# Altium schematic sheet 01.SchDoc
size A3; CompanyName: 瀬沼電子; Organization: 瀬沼電子; Address1: 〒197-0827; Address2: 東京都あきる野; Address3: 油平259; Phone: 042-558-0141; Rule: PcbType=ProtelPcb
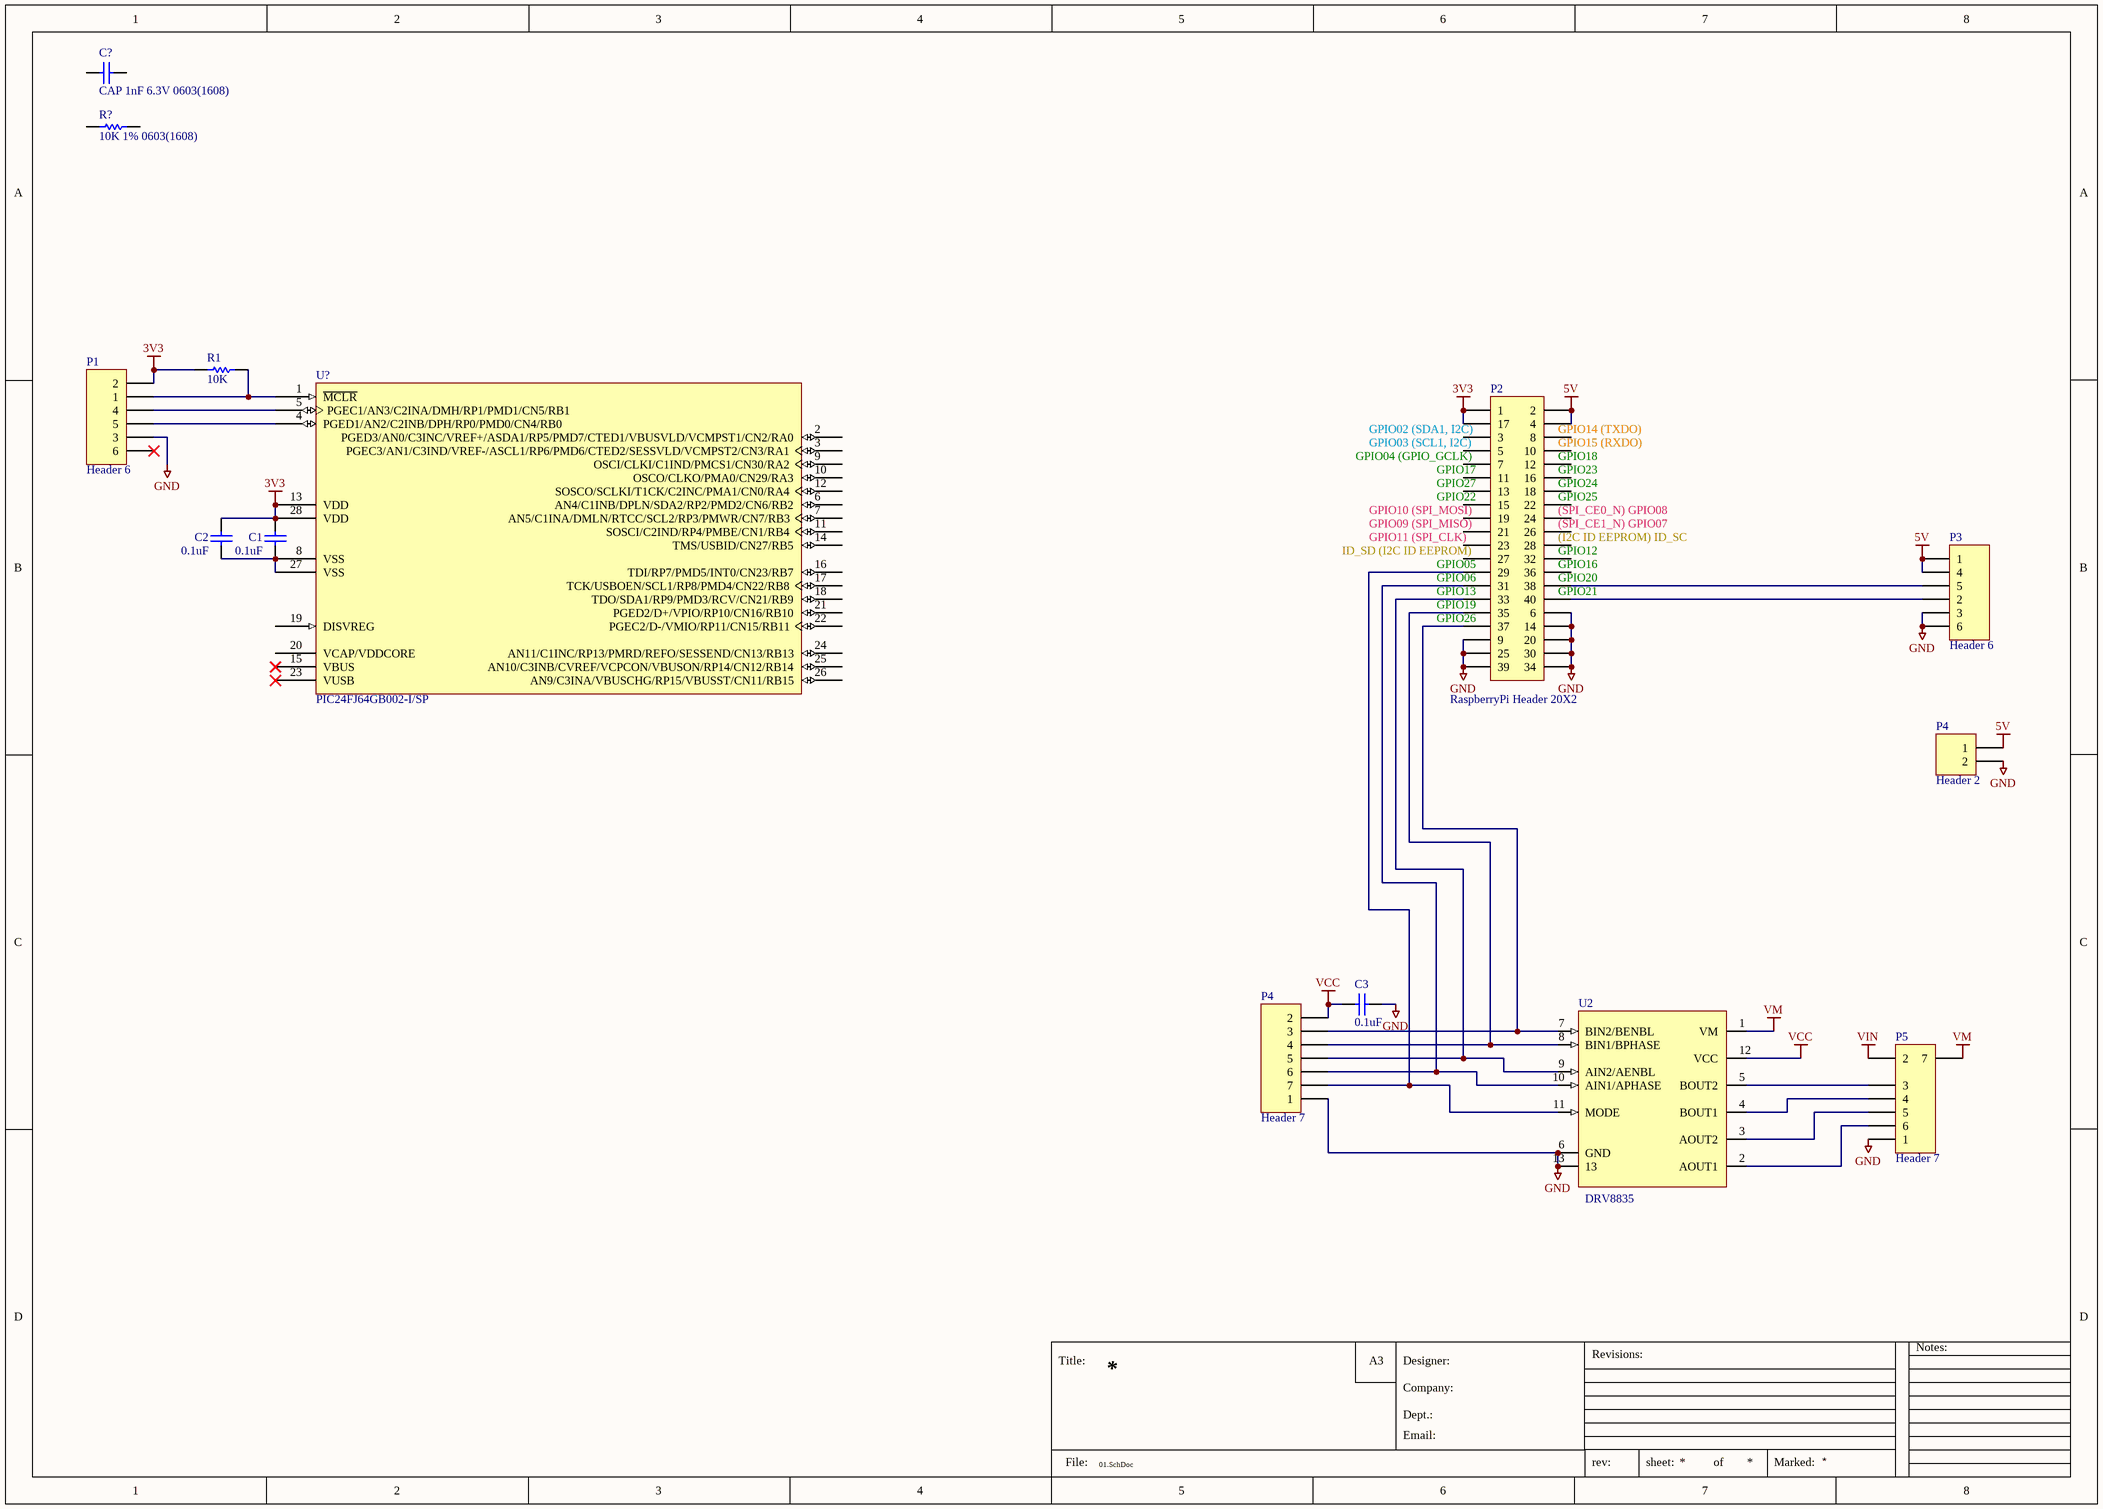
[diagram p0: 01.SchDoc]

## Parts
(Parts that share a designator on the sheet are numbered #1, #2 ... from top to bottom, then left to right.)
C1  value 0.1uF  [CAPC0603(1608)100_M]  (hidden comment: CAP 0.1uF 6.3V 0603(1608))
C2  value 0.1uF  [CAPC0603(1608)100_M]  (hidden comment: CAP 0.1uF 6.3V 0603(1608))
C3  value 0.1uF  [CAPC0603(1608)100_M]  (hidden comment: CAP 0.1uF 6.3V 0603(1608))
C?  CAP 1nF 6.3V 0603(1608)  [CAPC0603(1608)100_M]
P1  Header 6  [HDR1X6]
P2  RaspberryPi Header 20X2  [HDR2X20]
P3  Header 6  [HDR1X6]
P4#1  Header 2  [HDR1X2]
P4#2  Header 7  [HDR1X7]
P5  Header 7  [HDR1X7]
R1  10K  [RESC0603(1608)_N]
R?  10K 1% 0603(1608)  [RESC0603(1608)_N]
U2  DRV8835
U?  PIC24FJ64GB002-I/SP  [SPDIP300-SP28]

## Nets
3V3: C1.2 C2.2 P1.2 P2.1 P2.17 R1.2 U?.13(VDD) U?.28(VDD)
5V: P2.2 P2.4 P3.1 P3.4 P4#1.1
GND: C3.1 P1.3 P2.6 P2.9 P2.14 P2.20 P2.25 P2.30 P2.34 P2.39 P3.3 P3.6 P4#1.2 P4#2.1 P5.1 U2.6(GND) U2.13
VCC: C3.2 P4#2.2 U2.12(VCC)
VIN: P5.2
VM: P5.7 U2.1(VM)
NetC1_1: C1.1 C2.1 U?.8(VSS) U?.27(VSS)
NetP1_1: P1.1 R1.1 U?.1(~{MCLR})
NetP1_4: P1.4 U?.5(PGEC1/AN3/C2INA/DMH/RP1/PMD1/CN5/RB1)
NetP1_5: P1.5 U?.4(PGED1/AN2/C2INB/DPH/RP0/PMD0/CN4/RB0)
NetP2_29: P2.29 P4#2.7 U2.11(MODE)
NetP2_31: P2.31 P4#2.6 U2.10(AIN1/APHASE)
NetP2_33: P2.33 P4#2.5 U2.9(AIN2/AENBL)
NetP2_35: P2.35 P4#2.4 U2.8(BIN1/BPHASE)
NetP2_37: P2.37 P4#2.3 U2.7(BIN2/BENBL)
NetP2_38: P2.38 P3.5
NetP2_40: P2.40 P3.2
NetP5_3: P5.3 U2.5(BOUT2)
NetP5_4: P5.4 U2.4(BOUT1)
NetP5_5: P5.5 U2.3(AOUT2)
NetP5_6: P5.6 U2.2(AOUT1)

Not connected (* = marked no-connect by the designer): C? 1 2; P1 6*; P2 3 5 7 8 10 11 12 13 15 16 18 19 21 22 23 24 26 27 28 32 36; R? 1 2; U? 2(PGED3/AN0/C3INC/VREF+/ASDA1/RP5/PMD7/CTED1/VBUSVLD/VCMPST1/CN2/RA0) 3(PGEC3/AN1/C3IND/VREF-/ASCL1/RP6/PMD6/CTED2/SESSVLD/VCMPST2/CN3/RA1) 6(AN4/C1INB/DPLN/SDA2/RP2/PMD2/CN6/RB2) 7(AN5/C1INA/DMLN/RTCC/SCL2/RP3/PMWR/CN7/RB3) 9(OSCI/CLKI/C1IND/PMCS1/CN30/RA2) 10(OSCO/CLKO/PMA0/CN29/RA3) 11(SOSCI/C2IND/RP4/PMBE/CN1/RB4) 12(SOSCO/SCLKI/T1CK/C2INC/PMA1/CN0/RA4) 14(TMS/USBID/CN27/RB5) 15(VBUS)* 16(TDI/RP7/PMD5/INT0/CN23/RB7) 17(TCK/USBOEN/SCL1/RP8/PMD4/CN22/RB8) 18(TDO/SDA1/RP9/PMD3/RCV/CN21/RB9) 19(DISVREG) 20(VCAP/VDDCORE) 21(PGED2/D+/VPIO/RP10/CN16/RB10) 22(PGEC2/D-/VMIO/RP11/CN15/RB11) 23(VUSB)* 24(AN11/C1INC/RP13/PMRD/REFO/SESSEND/CN13/RB13) 25(AN10/C3INB/CVREF/VCPCON/VBUSON/RP14/CN12/RB14) 26(AN9/C3INA/VBUSCHG/RP15/VBUSST/CN11/RB15)

## Notes on the sheet
- (near P2) GPIO02 (SDA1, I2C)
- (near P2) GPIO03 (SCL1, I2C)
- (near P2) GPIO14 (TXDO)
- (near P2) GPIO15 (RXDO)
- (near P2) GPIO04 (GPIO_GCLK)
- (near P2) GPIO10 (SPI_MOSI)
- (near P2) GPIO17
- (near P2) GPIO22
- (near P2) GPIO27
- (near P2) (SPI_CE0_N) GPIO08
- (near P2) GPIO18
- (near P2) GPIO23
- (near P2) GPIO24
- (near P2) GPIO25
- (near P2) ID_SD (I2C ID EEPROM)
- (near P2) GPIO09 (SPI_MISO)
- (near P2) GPIO11 (SPI_CLK)
- (near P2) GPIO05
- (near P2) GPIO06
- (near P2) (SPI_CE1_N) GPIO07
- (near P2) GPIO12
- (near P2) GPIO16
- (near P2) GPIO20
- (near P2) (I2C ID EEPROM) ID_SC
- (near P2) GPIO13
- (near P2) GPIO19
- (near P2) GPIO26
- (near P2) GPIO21
- Title:
- A3
- Designer:
- Company:
- Revisions:
- Notes:
- Dept.:
- Email:
- File:
- rev:
- sheet:
- of
- Marked:

## Library data of the parts
C1-C3 = CMP-1035-01870-1: CAP 0.1uF 6.3V Â±20% 0603 (1608 Metric) Thickness 1mm SMD; Case-Metric: 1608; Case-EIA: 0603; Max Thickness: 1 mm; Rated Voltage: 6.3 V; Technology: SMT; Tolerance: Â±20%
C? = CMP-1035-01870-1: CAP 1nF 6.3V Â±20% 0603 (1608 Metric) Thickness 1mm SMD; Case-Metric: 1608; Case-EIA: 0603; Max Thickness: 1 mm; Rated Voltage: 6.3 V; Value: 1nF; Technology: SMT; Tolerance: Â±20%
P1 P3 = Header 6: Header, 6-Pin; LatestRevisionDate: 17-Jul-2002; LatestRevisionNote: Re-released for DXP Platform.; Publisher: Altium Limited
P2 = Header 20X2: Header, 20-Pin, Dual row; LatestRevisionDate: 17-Jul-2002; LatestRevisionNote: Re-released for DXP Platform.; Publisher: Altium Limited
P4#1 = Header 2: Header, 2-Pin; LatestRevisionDate: 17-Jul-2002; LatestRevisionNote: Re-released for DXP Platform.; Publisher: Altium Limited
P4#2 P5 = Header 7: Header, 7-Pin; LatestRevisionDate: 17-Jul-2002; LatestRevisionNote: Re-released for DXP Platform.; Publisher: Altium Limited
R1 = CMP-1012-00514-1: 10K 0.1W 1% 0603 (1608 Metric)  SMD; Case-Metric: 1608; Case-EIA: 0603; Technology: SMT; Tolerance: 1 %; Value: 10K; Power: 0.1 W
R? = CMP-1012-00514-1: 10K 0.1W 1% 0603 (1608 Metric)  SMD; Case-Metric: 1608; Case-EIA: 0603; Value: 10000 Ohm; Technology: SMT; Tolerance: 1 %; Power: 0.1 W
U? = CMP-0046-00015-2: 16-Bit Flash Microcontroller with USB On-The-Go and nanoWatt XLP, 64KB Flash, 8KB SRAM, 28-Pin SPDIP, Industrial Temperature; ComponentLink2URL: http://www.microchip.com/stellent/groups/techpub_sg/documents/packagingspec/en012702.pdf; PackageDescription: 28-Lead Skinny Plastic Dual In-Line (SP) - 300 mil Body [SPDIP]; PackageVersion: revBB, Aug-2009; RevisionNote: Component URLs added.; DatasheetVersion: revD, Aug-2010; ComponentLink1Description: Datasheet; ComponentLink2Description: Packaging Specification; ComponentLink1URL: http://ww1.microchip.com/downloads/en/DeviceDoc/39940d.pdf; PackageReference: SPDIP300-SP28; ComponentLink3Description: Microchip.com Home; ComponentLink3URL: http://www.microchip.com/